# Altium schematic sheet io_1.schdoc
size 297 x 209 mm; Symbol: Drawing-Symbol_A4; @Project Name: Odin; @Page Count: 9; @Update Date: 2025-12-16; @Create Date: 2025-12-16; @Schematic Name: Odin; @Page No: 9; @Page Name: io_1; Company: EasyEDA.com; Version: V1.0; Page Size: A4; @Create Time: 20:31:28; @Update Time: 15:31:42; Border: 1; Width: 1170; Height: 825; Region Start: 1; X Region Count: 6; Y Region Count: 4; Blade Width: 10; Title Block Position: 3; @Board Name: Odin_V1.0.0; Device: Drawing-Symbol_A4
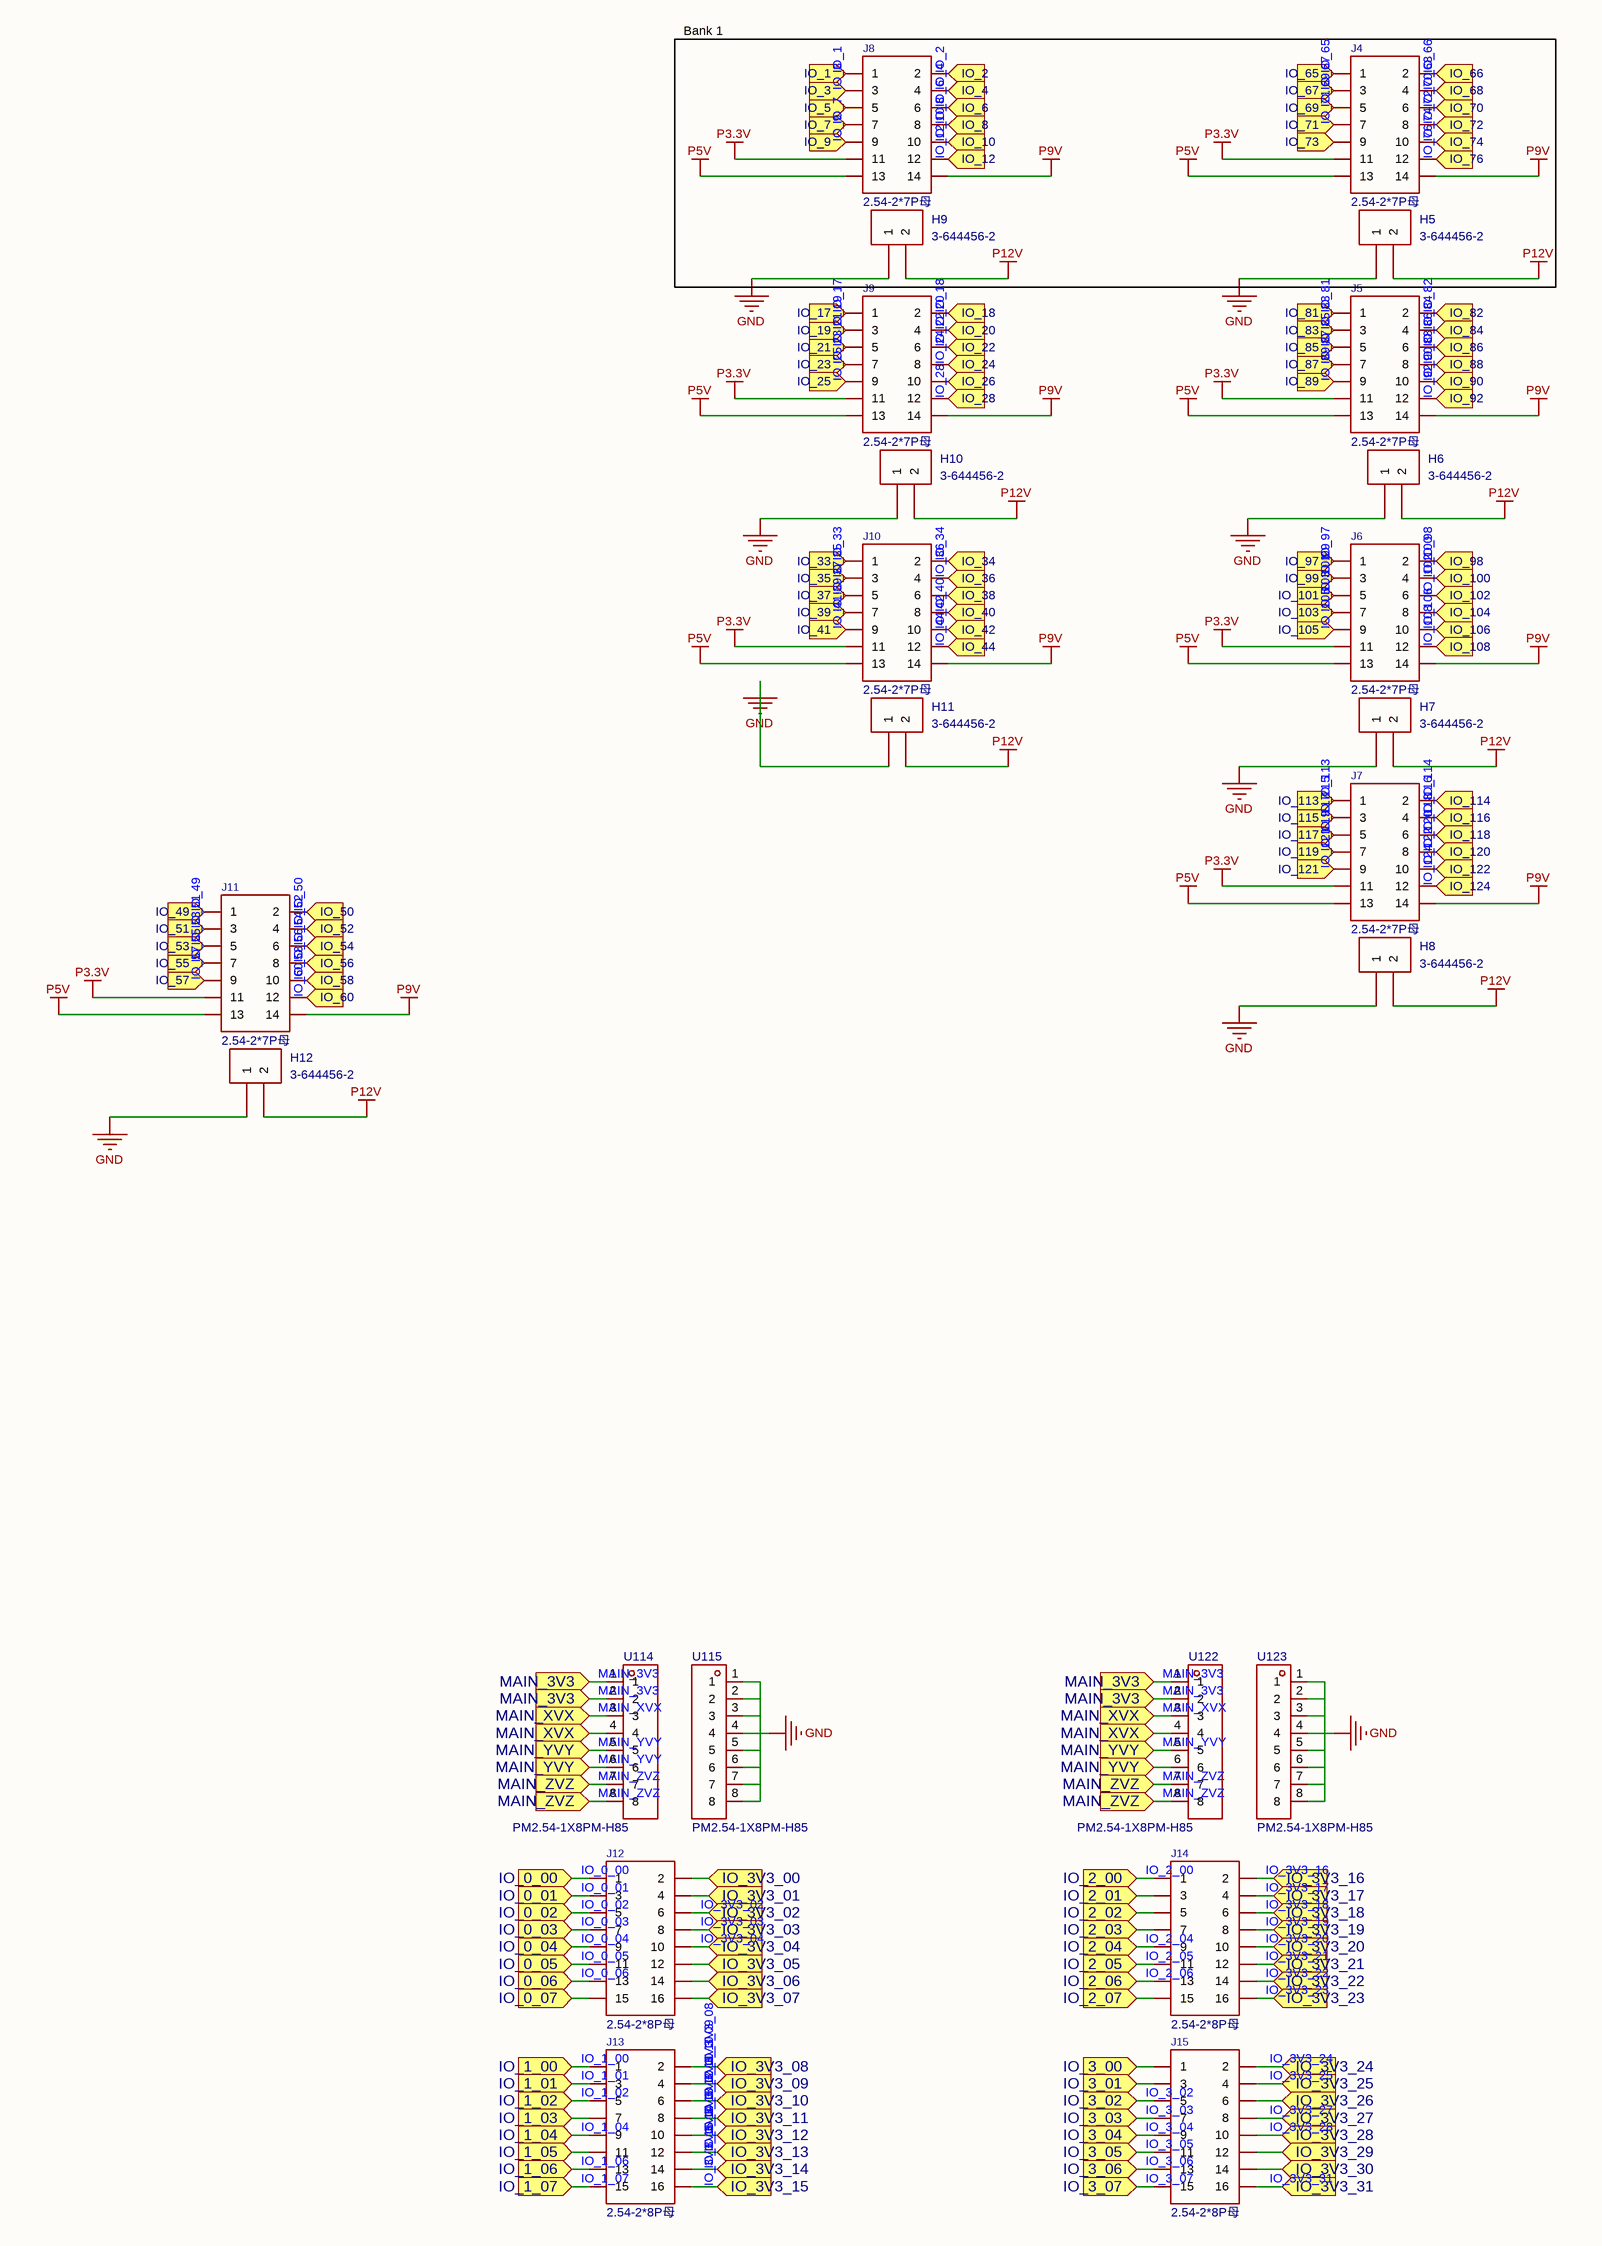
[diagram p0: io_1.schdoc]

## Parts
H5  3-644456-2  [HDR-TH_2P-P2.54-V-M-1]
H6  3-644456-2  [HDR-TH_2P-P2.54-V-M-1]
H7  3-644456-2  [HDR-TH_2P-P2.54-V-M-1]
H8  3-644456-2  [HDR-TH_2P-P2.54-V-M-1]
H9  3-644456-2  [HDR-TH_2P-P2.54-V-M-1]
H10  3-644456-2  [HDR-TH_2P-P2.54-V-M-1]
H11  3-644456-2  [HDR-TH_2P-P2.54-V-M-1]
H12  3-644456-2  [HDR-TH_2P-P2.54-V-M-1]
J4  2.54-2*7P母  [HDR-TH_14P-P2.54-V-F-R2-C7-S2.54-1]
J5  2.54-2*7P母  [HDR-TH_14P-P2.54-V-F-R2-C7-S2.54-1]
J6  2.54-2*7P母  [HDR-TH_14P-P2.54-V-F-R2-C7-S2.54-1]
J7  2.54-2*7P母  [HDR-TH_14P-P2.54-V-F-R2-C7-S2.54-1]
J8  2.54-2*7P母  [HDR-TH_14P-P2.54-V-F-R2-C7-S2.54-1]
J9  2.54-2*7P母  [HDR-TH_14P-P2.54-V-F-R2-C7-S2.54-1]
J10  2.54-2*7P母  [HDR-TH_14P-P2.54-V-F-R2-C7-S2.54-1]
J11  2.54-2*7P母  [HDR-TH_14P-P2.54-V-F-R2-C7-S2.54-1]
J12  2.54-2*8P母  [HDR-TH_16P-P2.54-V-F-R2-C8-S2.54]
J13  2.54-2*8P母  [HDR-TH_16P-P2.54-V-F-R2-C8-S2.54]
J14  2.54-2*8P母  [HDR-TH_16P-P2.54-V-F-R2-C8-S2.54]
J15  2.54-2*8P母  [HDR-TH_16P-P2.54-V-F-R2-C8-S2.54]
U114  PM2.54-1X8PM-H85  [HDR-TH_8P-P2.54-V-F]
U115  PM2.54-1X8PM-H85  [HDR-TH_8P-P2.54-V-F]
U122  PM2.54-1X8PM-H85  [HDR-TH_8P-P2.54-V-F]
U123  PM2.54-1X8PM-H85  [HDR-TH_8P-P2.54-V-F]

## Blocks framed on the sheet
Bank 1: H5 H9 J4 J8

## Ports
IO_0_00 (in), IO_0_01 (in), IO_0_02 (in), IO_0_03 (in), IO_0_04 (in), IO_0_05 (in), IO_0_06 (in), IO_0_07 (in), IO_1 (in), IO_1_00 (in), IO_1_01 (in), IO_1_02 (in), IO_1_03 (in), IO_1_04 (in), IO_1_05 (in), IO_1_06 (in), IO_1_07 (in), IO_2 (in), IO_2_00 (in), IO_2_01 (in), IO_2_02 (in), IO_2_03 (in), IO_2_04 (in), IO_2_05 (in), IO_2_06 (in), IO_2_07 (in), IO_3 (in), IO_3_00 (in), IO_3_01 (in), IO_3_02 (in), IO_3_03 (in), IO_3_04 (in), IO_3_05 (in), IO_3_06 (in), IO_3_07 (in), IO_3V3_00 (in), IO_3V3_01 (in), IO_3V3_02 (in), IO_3V3_03 (in), IO_3V3_04 (in), IO_3V3_05 (in), IO_3V3_06 (in), IO_3V3_07 (in), IO_3V3_08 (in), IO_3V3_09 (in), IO_3V3_10 (in), IO_3V3_11 (in), IO_3V3_12 (in), IO_3V3_13 (in), IO_3V3_14 (in), IO_3V3_15 (in), IO_3V3_16 (in), IO_3V3_17 (in), IO_3V3_18 (in), IO_3V3_19 (in), IO_3V3_20 (in), IO_3V3_21 (in), IO_3V3_22 (in), IO_3V3_23 (in), IO_3V3_24 (in), IO_3V3_25 (in), IO_3V3_26 (in), IO_3V3_27 (in), IO_3V3_28 (in), IO_3V3_29 (in), IO_3V3_30 (in), IO_3V3_31 (in), IO_4 (in), IO_5 (in), IO_6 (in), IO_7 (in), IO_8 (in), IO_9 (in), IO_10 (in), IO_12 (in), IO_17 (in), IO_18 (in), IO_19 (in), IO_20 (in), IO_21 (in), IO_22 (in), IO_23 (in), IO_24 (in), IO_25 (in), IO_26 (in), IO_28 (in), IO_33 (in), IO_34 (in), IO_35 (in), IO_36 (in), IO_37 (in), IO_38 (in), IO_39 (in), IO_40 (in), IO_41 (in), IO_42 (in), IO_44 (in), IO_49 (in), IO_50 (in), IO_51 (in), IO_52 (in), IO_53 (in), IO_54 (in), IO_55 (in), IO_56 (in), IO_57 (in), IO_58 (in), IO_60 (in), IO_65 (in), IO_66 (in), IO_67 (in), IO_68 (in), IO_69 (in), IO_70 (in), IO_71 (in), IO_72 (in), IO_73 (in), IO_74 (in), IO_76 (in), IO_81 (in), IO_82 (in), IO_83 (in), IO_84 (in), IO_85 (in), IO_86 (in), IO_87 (in), IO_88 (in), IO_89 (in), IO_90 (in), IO_92 (in), IO_97 (in), IO_98 (in), IO_99 (in), IO_100 (in), IO_101 (in), IO_102 (in), IO_103 (in), IO_104 (in), IO_105 (in), IO_106 (in), IO_108 (in), IO_113 (in), IO_114 (in), IO_115 (in), IO_116 (in), IO_117 (in), IO_118 (in), IO_119 (in), IO_120 (in), IO_121 (in), IO_122 (in), IO_124 (in), MAIN_3V3 (in), MAIN_XVX (in), MAIN_YVY (in), MAIN_ZVZ (in)

## Nets
GND: H5.1 H6.1 H7.1 H8.1 H9.1 H10.1 H11.1 H12.1 U115.1 U115.2 U115.3 U115.4 U115.5 U115.6 U115.7 U115.8 U123.1 U123.2 U123.3 U123.4 U123.5 U123.6 U123.7 U123.8
P3.3V: J4.11 J5.11 J6.11 J7.11 J8.11 J9.11 J10.11 J11.11
P5V: J4.13 J5.13 J6.13 J7.13 J8.13 J9.13 J10.13 J11.13
P9V: J4.14 J5.14 J6.14 J7.14 J8.14 J9.14 J10.14 J11.14
P12V: H5.2 H6.2 H7.2 H8.2 H9.2 H10.2 H11.2 H12.2
IO_0_00: J12.1 ; port IO_0_00
IO_0_01: J12.3 ; port IO_0_01
IO_0_02: J12.5 ; port IO_0_02
IO_0_03: J12.7 ; port IO_0_03
IO_0_04: J12.9 ; port IO_0_04
IO_0_05: J12.11 ; port IO_0_05
IO_0_06: J12.13 ; port IO_0_06
IO_0_07: J12.15 ; port IO_0_07
IO_1: J8.1 ; port IO_1
IO_1_00: J13.1 ; port IO_1_00
IO_1_01: J13.3 ; port IO_1_01
IO_1_02: J13.5 ; port IO_1_02
IO_1_03: J13.7 ; port IO_1_03
IO_1_04: J13.9 ; port IO_1_04
IO_1_05: J13.11 ; port IO_1_05
IO_1_06: J13.13 ; port IO_1_06
IO_1_07: J13.15 ; port IO_1_07
IO_2: J8.2 ; port IO_2
IO_2_00: J14.1 ; port IO_2_00
IO_2_01: J14.3 ; port IO_2_01
IO_2_02: J14.5 ; port IO_2_02
IO_2_03: J14.7 ; port IO_2_03
IO_2_04: J14.9 ; port IO_2_04
IO_2_05: J14.11 ; port IO_2_05
IO_2_06: J14.13 ; port IO_2_06
IO_2_07: J14.15 ; port IO_2_07
IO_3: J8.3 ; port IO_3
IO_3_00: J15.1 ; port IO_3_00
IO_3_01: J15.3 ; port IO_3_01
IO_3_02: J15.5 ; port IO_3_02
IO_3_03: J15.7 ; port IO_3_03
IO_3_04: J15.9 ; port IO_3_04
IO_3_05: J15.11 ; port IO_3_05
IO_3_06: J15.13 ; port IO_3_06
IO_3_07: J15.15 ; port IO_3_07
IO_3V3_00: J12.2 ; port IO_3V3_00
IO_3V3_01: J12.4 ; port IO_3V3_01
IO_3V3_02: J12.6 ; port IO_3V3_02
IO_3V3_03: J12.8 ; port IO_3V3_03
IO_3V3_04: J12.10 ; port IO_3V3_04
IO_3V3_05: J12.12 ; port IO_3V3_05
IO_3V3_06: J12.14 ; port IO_3V3_06
IO_3V3_07: J12.16 ; port IO_3V3_07
IO_3V3_08: J13.2 ; port IO_3V3_08
IO_3V3_09: J13.4 ; port IO_3V3_09
IO_3V3_10: J13.6 ; port IO_3V3_10
IO_3V3_11: J13.8 ; port IO_3V3_11
IO_3V3_12: J13.10 ; port IO_3V3_12
IO_3V3_13: J13.12 ; port IO_3V3_13
IO_3V3_14: J13.14 ; port IO_3V3_14
IO_3V3_15: J13.16 ; port IO_3V3_15
IO_3V3_16: J14.2 ; port IO_3V3_16
IO_3V3_17: J14.4 ; port IO_3V3_17
IO_3V3_18: J14.6 ; port IO_3V3_18
IO_3V3_19: J14.8 ; port IO_3V3_19
IO_3V3_20: J14.10 ; port IO_3V3_20
IO_3V3_21: J14.12 ; port IO_3V3_21
IO_3V3_22: J14.14 ; port IO_3V3_22
IO_3V3_23: J14.16 ; port IO_3V3_23
IO_3V3_24: J15.2 ; port IO_3V3_24
IO_3V3_25: J15.4 ; port IO_3V3_25
IO_3V3_26: J15.6 ; port IO_3V3_26
IO_3V3_27: J15.8 ; port IO_3V3_27
IO_3V3_28: J15.10 ; port IO_3V3_28
IO_3V3_29: J15.12 ; port IO_3V3_29
IO_3V3_30: J15.14 ; port IO_3V3_30
IO_3V3_31: J15.16 ; port IO_3V3_31
IO_4: J8.4 ; port IO_4
IO_5: J8.5 ; port IO_5
IO_6: J8.6 ; port IO_6
IO_7: J8.7 ; port IO_7
IO_8: J8.8 ; port IO_8
IO_9: J8.9 ; port IO_9
IO_10: J8.10 ; port IO_10
IO_12: J8.12 ; port IO_12
IO_17: J9.1 ; port IO_17
IO_18: J9.2 ; port IO_18
IO_19: J9.3 ; port IO_19
IO_20: J9.4 ; port IO_20
IO_21: J9.5 ; port IO_21
IO_22: J9.6 ; port IO_22
IO_23: J9.7 ; port IO_23
IO_24: J9.8 ; port IO_24
IO_25: J9.9 ; port IO_25
IO_26: J9.10 ; port IO_26
IO_28: J9.12 ; port IO_28
IO_33: J10.1 ; port IO_33
IO_34: J10.2 ; port IO_34
IO_35: J10.3 ; port IO_35
IO_36: J10.4 ; port IO_36
IO_37: J10.5 ; port IO_37
IO_38: J10.6 ; port IO_38
IO_39: J10.7 ; port IO_39
IO_40: J10.8 ; port IO_40
IO_41: J10.9 ; port IO_41
IO_42: J10.10 ; port IO_42
IO_44: J10.12 ; port IO_44
IO_49: J11.1 ; port IO_49
IO_50: J11.2 ; port IO_50
IO_51: J11.3 ; port IO_51
IO_52: J11.4 ; port IO_52
IO_53: J11.5 ; port IO_53
IO_54: J11.6 ; port IO_54
IO_55: J11.7 ; port IO_55
IO_56: J11.8 ; port IO_56
IO_57: J11.9 ; port IO_57
IO_58: J11.10 ; port IO_58
IO_60: J11.12 ; port IO_60
IO_65: J4.1 ; port IO_65
IO_66: J4.2 ; port IO_66
IO_67: J4.3 ; port IO_67
IO_68: J4.4 ; port IO_68
IO_69: J4.5 ; port IO_69
IO_70: J4.6 ; port IO_70
IO_71: J4.7 ; port IO_71
IO_72: J4.8 ; port IO_72
IO_73: J4.9 ; port IO_73
IO_74: J4.10 ; port IO_74
IO_76: J4.12 ; port IO_76
IO_81: J5.1 ; port IO_81
IO_82: J5.2 ; port IO_82
IO_83: J5.3 ; port IO_83
IO_84: J5.4 ; port IO_84
IO_85: J5.5 ; port IO_85
IO_86: J5.6 ; port IO_86
IO_87: J5.7 ; port IO_87
IO_88: J5.8 ; port IO_88
IO_89: J5.9 ; port IO_89
IO_90: J5.10 ; port IO_90
IO_92: J5.12 ; port IO_92
IO_97: J6.1 ; port IO_97
IO_98: J6.2 ; port IO_98
IO_99: J6.3 ; port IO_99
IO_100: J6.4 ; port IO_100
IO_101: J6.5 ; port IO_101
IO_102: J6.6 ; port IO_102
IO_103: J6.7 ; port IO_103
IO_104: J6.8 ; port IO_104
IO_105: J6.9 ; port IO_105
IO_106: J6.10 ; port IO_106
IO_108: J6.12 ; port IO_108
IO_113: J7.1 ; port IO_113
IO_114: J7.2 ; port IO_114
IO_115: J7.3 ; port IO_115
IO_116: J7.4 ; port IO_116
IO_117: J7.5 ; port IO_117
IO_118: J7.6 ; port IO_118
IO_119: J7.7 ; port IO_119
IO_120: J7.8 ; port IO_120
IO_121: J7.9 ; port IO_121
IO_122: J7.10 ; port IO_122
IO_124: J7.12 ; port IO_124
MAIN_3V3: U114.1 U114.2 U122.1 U122.2 ; port MAIN_3V3
MAIN_XVX: U114.3 U114.4 U122.3 U122.4 ; port MAIN_XVX
MAIN_YVY: U114.5 U114.6 U122.5 U122.6 ; port MAIN_YVY
MAIN_ZVZ: U114.7 U114.8 U122.7 U122.8 ; port MAIN_ZVZ

## Notes on the sheet
- Create at
- 2025-12-16
- Schematic
- Board
- Odin
- Odin_V1.0.0
- Update at
- Page
- io_1
- Drawn
- Reviewed
- Version
- V1.0
- Size
- A4
- Page  9  Total  9
- EasyEDA.com

## Library data of the parts
H5-H12 = 3-644456-2: Pin Structure:1x2P Pitch:2.54mm Row Spacing:- Circluar Pins/Square Pins:Policy Mounting Type:Direct Insert Number of Rows:Single Row Number of Pins:2P Current Rating (Max):- Voltage Rating (Max):250V Length of Mating Pin:- Insulation Height:- Contact Mate; Manufacturer: TE Connectivity(泰科电子); AddInBom: yes; ModelId: e506c2b6a89c4aacb020357246aab725; ModelName: HDR-M-2.54_1x2; ModelTransform: 200,100,0,0,0,0,0,0,-118.11; Pin Structure: 1x2P; Pitch: 2.54mm; Circluar Pins/Square Pins: Policy; Voltage Rating (Max): 250V; Symbol: 3-644456-2; Device: 3-644456-2; LCSC Part Name: 间距:2.54mm 1x2P 直插 方针; SupplierPart: C90288; ManufacturerPart: 3-644456-2; Supplier Footprint: 插件,P=2.54mm; JLCPCB Part Class: Extended Part; Datasheet: https://atta.szlcsc.com/upload/public/pdf/source/20180326/C90288_7C19199EB85874EC46E1694096B0EFF6.pdf; Supplier: LCSC; ConvertToPcb: yes; FootprintName: HDR-TH_2P-P2.54-V-M-1; Row Spacing: -; Mounting Type: Direct Insert; Number of Rows: Single Row; Number of Pins: 2P; Current Rating (Max): -; Length of Mating Pin: -; Insulation Height: -; Contact Material: Copper alloy; Contact Plating: Tin; Operating Temperature Range: -55℃~+105℃; Color: White
J4-J11 = 2.54-2*7P母: Holes Structure:2x7P Pitch:2.54mm Row Spacing:2.54mm Mounting Type:Straight Number of Rows:双排 Number of Holes:14P Insulation Height:- Contact Material:Brass Contact Plating:-; Manufacturer: BOOMELE(博穆精密); Symbol: Header-Female-2.54_2x7; AddInBom: yes; ModelId: 762696a6daaa4deb8ed0f666f52eca34; ModelTransform: 699.9986,200,0,0,0,0,0,0,-118.11; Holes Structure: 2x7P; Pitch: 2.54mm; Number of Holes: 14P; Device: 2.54-2*7P母; Supplier: LCSC; Manufacturer Part: 2.54-2*7P母; Supplier Part: C38844; JLCPCB Part Class: Extended Part; LCSC Part Name: 间距:2.54mm 2x7P 直插; Supplier Footprint: 插件,P=2.54mm; ConvertToPcb: yes; FootprintName: HDR-TH_14P-P2.54-V-F-R2-C7-S2.54-1; ModelName: HDR-TH_14P-P2.54-V-F-R2-C7-S2.54-1; Row Spacing: 2.54mm; Mounting Type: Straight; Number of Rows: 双排; Insulation Height: -; Contact Material: Brass; Contact Plating: -
J12-J15 = 2.54-2*8P母: Holes Structure:2x8P Pitch:2.54mm Row Spacing:2.54mm Circular Hole / Square Hole:Square Hole Mounting Type:Through Hole Number of Rows:2 Number of Positions:16P Current Rating:2.5A Holes Direction:Top Insulation Height:8.5mm Contact Material:Brass Contact; Manufacturer: BOOMELE(博穆精密); Symbol: Header-Female-2.54_2x8; AddInBom: yes; ModelId: 0227b0d256bf4f04baed749f079520a9; ModelName: HDR-TH_16P-P2.54-F-LI-2X8P; ModelTransform: 815.746,196.85,0,0,0,0,0,0,-129.921; Holes Structure: 2x8P; Pitch: 2.54mm; Number of Positions: 16P; Current Rating: 2.5A; Holes Direction: Top; PIN Length: 3.1mm; Device: 2.54-2*8P母; Supplier: LCSC; Manufacturer Part: 2.54-2*8P母; Supplier Part: C30734; JLCPCB Part Class: Extended Part; LCSC Part Name: 2x8P 间距:2.54mm 直插; Supplier Footprint: 插件,P=2.54mm; Datasheet: https://item.szlcsc.com/datasheet/2.54-2*8P%25E6%25AF%258D/31491.html; ConvertToPcb: yes; FootprintName: HDR-TH_16P-P2.54-V-F-R2-C8-S2.54; Row Spacing: 2.54mm; Circular Hole / Square Hole: Square Hole; Mounting Type: Through Hole; Number of Rows: 2; Insulation Height: 8.5mm; Contact Material: Brass; Contact Plating: Gold; Operating Temperature: -55℃~+105℃
U114 U115 U122 U123 = PM2.54-1X8PM-H85: Holes Structure:1x8P Pitch:2.54mm Row Spacing:- Circular Hole / Square Hole:Square Hole Mounting Type:Through Hole Number of Rows:1 Number of Positions:8P Current Rating:3A Voltage Rating (Max):- Holes Direction:Top Insulation Height:8.5mm Contact Materia; Manufacturer: JXTCONN(聚兴泰); AddInBom: yes; ModelId: b6973b7031d646fcba0ebf3d3eaa05f4; ModelName: HDR-TH_8P-P2.54-F-LI-1X8P; ModelTransform: 815.746,94.488,0,0,0,0,0,0,-118.11; Holes Structure: 1x8P; Pitch: 2.54mm; Number of Positions: 8P; Current Rating: 3A; Holes Direction: Top; Symbol: PM2.54-1X8PM-H85; Device: PM2.54-1X8PM-H85; LCSC Part Name: 1x8P 间距:2.54mm 直插; SupplierPart: C42431840; ManufacturerPart: PM2.54-1X8PM-H85; Supplier Footprint: 插件,P=2.54mm; JLCPCB Part Class: Extended Part; Datasheet: https://item.szlcsc.com/datasheet/PM2.54-1X8PM-H85/44458970.html; Supplier: LCSC; ConvertToPcb: yes; FootprintName: HDR-TH_8P-P2.54-V-F; Row Spacing: -; Circular Hole / Square Hole: Square Hole; Mounting Type: Through Hole; Number of Rows: 1; Voltage Rating (Max): -; Insulation Height: 8.5mm; Contact Material: -; Contact Plating: Gold; Operating Temperature: -40℃~+105℃